# Altium schematic sheet CPLD_Programming.SchDoc
size A4; CompanyName: Technische Hochschule Nürnberg Georg Simon Ohm; Organization: UltraZohm; Address1: Kesslerplatz 12; Address2: 90489 Nürnberg; Address3: GERMANY; SheetNumber: 13; SheetTotal: 36; Website: www.ultrazohm.com
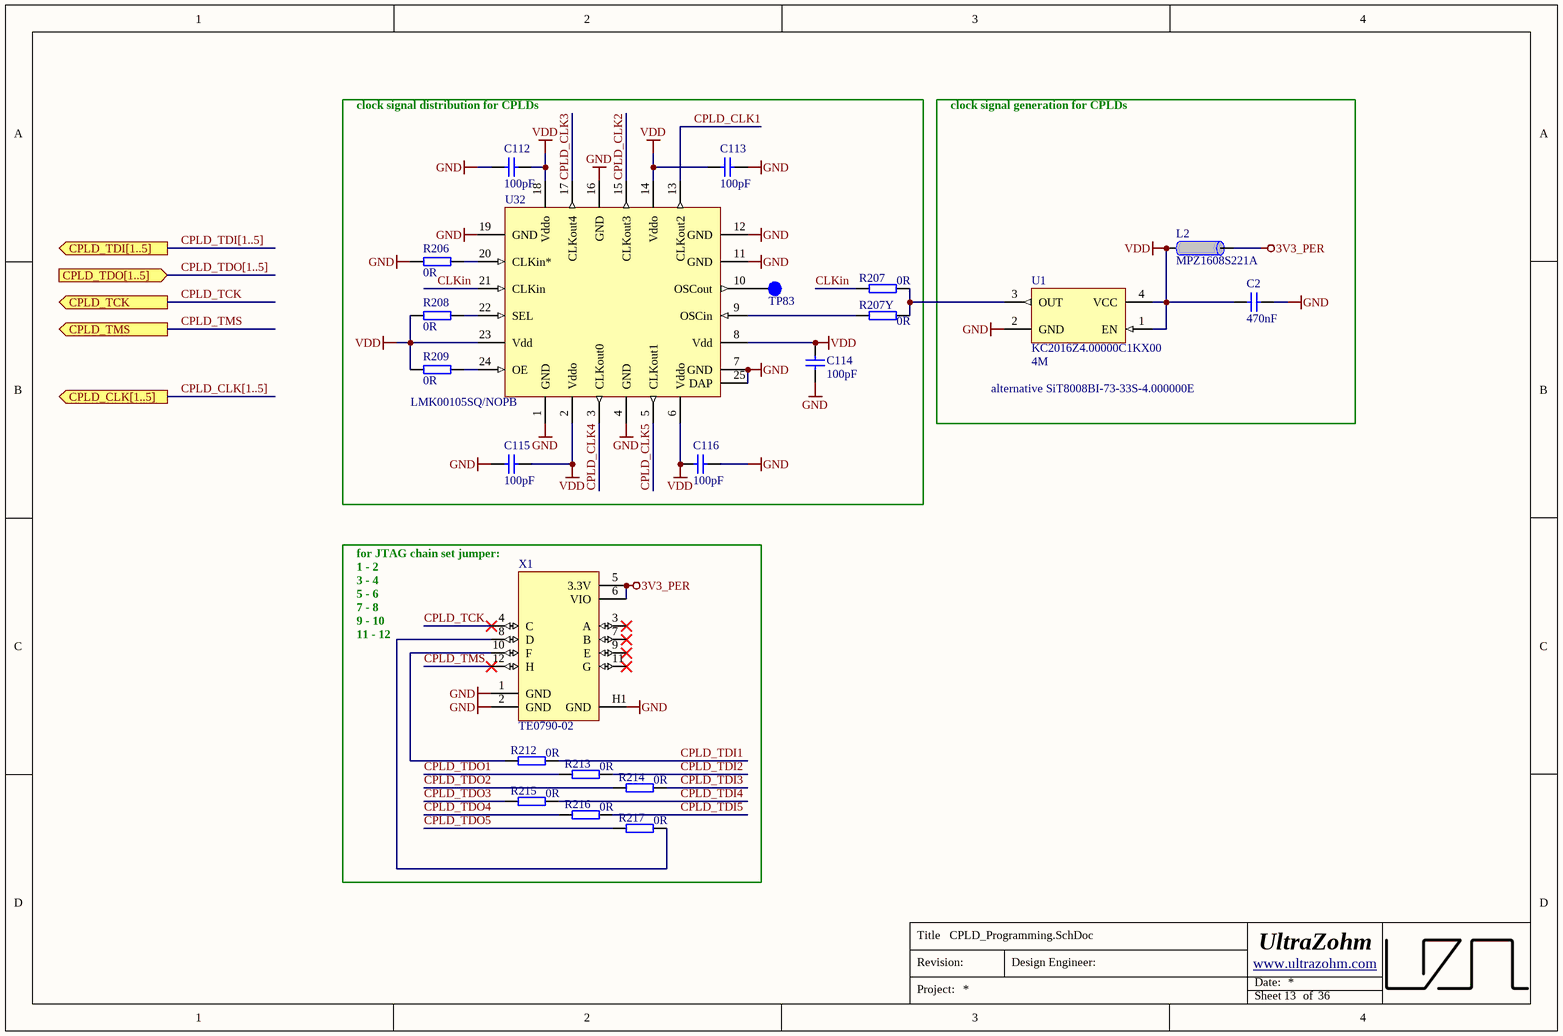
[diagram p0: CPLD_Programming.SchDoc]

## Parts
C2  470nF  [CAPC1608X90N_V]
C112  100pF  [CAPC1608X90N_V]
C113  100pF  [CAPC1608X90N_V]
C114  100pF  [CAPC1608X90N_V]
C115  100pF  [CAPC1608X90N_V]
C116  100pF  [CAPC1608X90N_V]
L2  MPZ1608S221A  [INDC1608X95N_V]
R206  0R  [R_0603_TE]
R207  0R  [R_0603_TE]
R207Y  0R  [R_0603_TE]
R208  0R  [R_0603_TE]
R209  0R  [R_0603_TE]
R212  0R  [R_0603_TE]
R213  0R  [R_0603_TE]
R214  0R  [R_0603_TE]
R215  0R  [R_0603_TE]
R216  0R  [R_0603_TE]
R217  0R  [R_0603_TE]
TP83  Testpoint 1mm  [TP_1mm]  (value not drawn)
U1  KC2016Z4.00000C1KX00  value 4M  [2016]
U32  LMK00105SQ/NOPB  [QFN50P400X400X80-25N]
X1  TE0790-02  [TE0790-Base]

## Blocks framed on the sheet
clock signal distribution for CPLDs: C112-C116 R206 R207 R207Y R208 R209 TP83 U32

## Ports
CPLD_CLK[1..5] (out), CPLD_TCK (out), CPLD_TDI[1..5] (out), CPLD_TDO[1..5] (in), CPLD_TMS (out)

## Nets
3V3_PER: L2.2 X1.5(3.3V) X1.6(VIO)
GND: C2.1 C112.2 C113.1 C114.2 C115.2 C116.1 R206.2 U1.2(GND) U32.1(GND) U32.4(GND) U32.7(GND) U32.11(GND) U32.12(GND) U32.16(GND) U32.19(GND) U32.25(DAP) X1.1(GND) X1.2(GND) X1.H1(GND)
VDD: C2.2 C112.1 C113.2 C114.1 C115.1 C116.2 L2.1 R208.1 R209.2 U1.1(EN) U1.4(VCC) U32.2(Vddo) U32.6(Vddo) U32.8(Vdd) U32.14(Vddo) U32.18(Vddo) U32.23(Vdd)
CLKin: R207.1 U32.21(CLKin)
CPLD_CLK1: U32.13(CLKout2)
CPLD_CLK2: U32.15(CLKout3)
CPLD_CLK3: U32.17(CLKout4)
CPLD_CLK4: U32.3(CLKout0)
CPLD_CLK5: U32.5(CLKout1)
CPLD_TCK: X1.4(C) ; port CPLD_TCK
CPLD_TDI1: R212.2
CPLD_TDI2: R213.2
CPLD_TDI3: R214.2
CPLD_TDI4: R215.2
CPLD_TDI5: R216.2
CPLD_TDO1: R213.1
CPLD_TDO2: R214.1
CPLD_TDO3: R215.1
CPLD_TDO4: R216.1
CPLD_TDO5: R217.1
CPLD_TMS: X1.12(H) ; port CPLD_TMS
NetR206_1: R206.1 U32.20(CLKin*)
NetR207_2: R207.2 R207Y.2 U1.3(OUT)
NetR207Y_1: R207Y.1 U32.9(OSCin)
NetR208_2: R208.2 U32.22(SEL)
NetR209_1: R209.1 U32.24(OE)
NetR212_1: R212.1 X1.10(F)
NetR217_2: R217.2 X1.8(D)
NetTP83_1: TP83.1 U32.10(OSCout)

Not connected (* = marked no-connect by the designer): X1 3(A)* 7(B)* 9(E)* 11(G)*

## Buses and harness runs
bus CPLD_CLK[1..5] = port CPLD_CLK[1..5]
bus CPLD_TDI[1..5] = port CPLD_TDI[1..5]
bus CPLD_TDO[1..5] = port CPLD_TDO[1..5]

## Notes on the sheet
- clock signal generation for CPLDs
- alternative SiT8008BI-73-33S-4.000000E
- (near X1) for JTAG chain set jumper:
  1 - 2
  3 - 4
  5 - 6
  7 - 8
  9 - 10
  11 - 12
- Title
- Revision:
- Design Engineer:
- Date:
- Project:
- Sheet
- of

## Library data of the parts
C2 = 25476: KON 470nF 50V X7R SMD  BF 1608 (0603); Value: 470n; AN: 25476; Mixed: SMT; Preferred: Yes; Temperature-Range: -55/+125; Voltage: 50V; Technology: X7R; Case: 1608 (0603)
C112-C116 = 21381: KON 100pF 50V NP0 ±5% SMD BF 1608 (0603); Value: 100p; AN: 21381; Mixed: SMT; Preferred: Yes; Tolerance: ±5%; Voltage: 50V; Technology: C0G NP0; Case: 1608 (0603)
L2 = 22718: Ferritdurchführung MPZ1608S221A; Value: 220 OHm @ 100MHz; AN: 22718; Mixed: SMT; Trenz-Stock: Yes; Temperature-Range: -55/+125; Extra: 0,05 Ohm DC, 220 Ohm bei 100MHz. 2A; Case: 1608 (0603); HelpURL: B:\AD\adlib\datasheet\MPZ1608; Preferred: Yes; H-ART: MPZ1608S221A; Storage-Temperature: -55/+125
R206 R207 R207Y R208 R209 R212-R217 = UZgen_R_0603_0R: Generic resistor; Manufacturer: UZgen; Tolerance: 1 %; Created from: UZgenTool; Value: 0R; Manufacturer Part Number: UZgen_R_0603_0R; PartID: 581; Created On: 08.07.2024 14:34:30; Device Package: 0603; Mounting Type: SMD; Last Updated: 08.07.2024 14:34:30
TP83 = 25063: AN: 25063; Mixed: SMT
U1 = 30896: KC2016Z4.00000C1KX00 Oszillator 4.000000MHz; AN: 30896; Voltage: 1.8-3.3V; Tolerance: 20ppm; Mixed: SMT; Temperature-Range: -40/+85; Extra: 1.71 - 3.63V, -40° C - 85° C , ±20 ppm , 2x1,6 mm; Case: 2.0  x 1.6mm; HelpURL: b:\AD\adlib\datasheet\Kyocera\KCxxxxZ\; H-ART: KC2016Z4.00000C1KX00; Storage-Temperature: -55/+150(Abs)
U32 = 30774: AN: 30774; Mixed: SMT; Temperature-Range: -40/+85; Extra: Clock Fanout Buffer (Distribution), Multiplexer, Translator 2:5 200MHz 24-WFQN; Case: WQFN24; HelpURL: b:\AD\adlib\datasheet\TI\LMK00105\; H-ART: LMK00105SQ/NOPB; Storage-Temperature: -65/+150 (Tj Abs)
X1 = TE0790-02: Adapter USG, JTAG, XMOD, FTDI 2CH; Manufacturer: Trenz Electronic GmbH; Value: USB, JTAG, XMOD; Created from: MGremer; Manufacturer Part Number: TE0790-02; PartID: 1; Created On: 20.01.2021 11:19:04; ComponentLink1Description: Datasheet; ComponentLink1URL: https://www.ftdichip.com/Support/Documents/DataSheets/ICs/DS_FT2232H.pdf; Component Type: Adapter USB, JTAG, XMOD; Device Package: PCB; Last Updated: 20.01.2021 11:19:04; Mounting Type: THT; Supplier 1: Digikey; Supplier Part Number 1: 1686-1023-ND; Type: Adapter; Live Cycle Status: 1; Stock number: not stored